# EAGLE design esp (EAGLE 7.5.0)

## Sheet 1 of 2
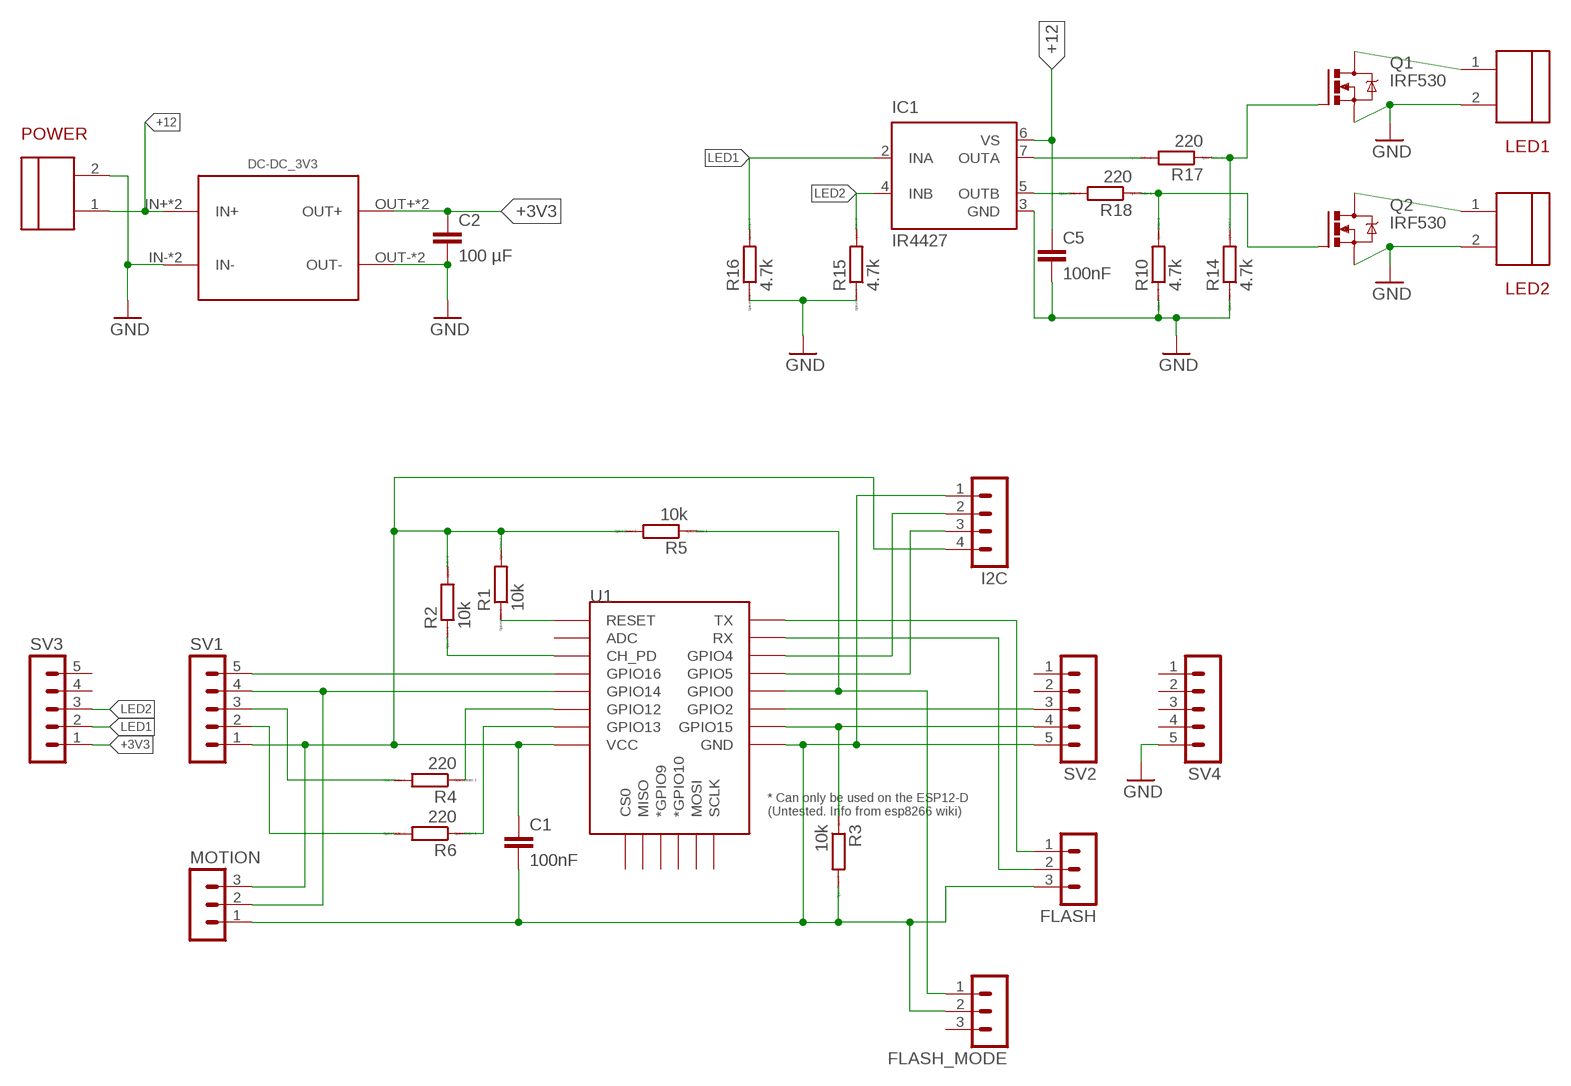
[diagram p0: schematic, sheet 1]

### Parts
C1  100nF  CAPPTH1  [CAP-PTH-5MM]
C2  100 µF  CAPPTH1  [CAP-PTH-5MM]
C5  100nF  CAPPTH1  [CAP-PTH-5MM]
DC-DC_3V3  DC-DC-MP1504EN  [DC-DC-MP1504EN]
FLASH  MA03-1  [MA03-1]
FLASH_MODE  MA03-1  [MA03-1]
I2C  MA04-1  [MA04-1]
IC1  IR4427  [DIL08]
LED1  DG3502P  [DG350]
LED2  DG3502P  [DG350]
MOTION  MA03-1  [MA03-1]
POWER  DG3502P  [DG350]
Q1  IRF530  [TO220BV]
Q2  IRF530  [TO220BV]
R1  10k  RR1206  [R1206]
R2  10k  RR1206  [R1206]
R3  10k  RR1206  [R1206]
R4  220  RR1206  [R1206]
R5  10k  RR1206  [R1206]
R6  220  RR1206  [R1206]
R10  4.7k  RR1206  [R1206]
R14  4.7k  RR1206  [R1206]
R15  4.7k  RR1206  [R1206]
R16  4.7k  RR1206  [R1206]
R17  220  RR1206  [R1206]
R18  220  RR1206  [R1206]
SV1  MA05-1  [MA05-1]
SV2  MA05-1  [MA05-1]
SV3  MA05-1  [MA05-1]
SV4  MA05-1  [MA05-1]
U1  ESP12ESMD  [ESP12E-SMD]

### Nets
+3V3: C2.1 DC-DC_3V3.OUT2+(OUT+) DC-DC_3V3.OUT+ SV3.1
+12: C5.1 DC-DC_3V3.IN2+(IN+) DC-DC_3V3.IN+ IC1.6(VS) POWER.1
GND: C2.2 C5.2 DC-DC_3V3.IN2-(IN-) DC-DC_3V3.IN- DC-DC_3V3.OUT2-(OUT-) DC-DC_3V3.OUT- IC1.3(GND) LED1.2 LED2.2 POWER.2 Q1.S Q2.S R10.1 R14.1 R15.1 R16.1 SV4.5
LED1: IC1.2(INA) R16.2 SV3.2
LED2: IC1.4(INB) R15.2 SV3.3
MOTION_SENSOR: MOTION.2 SV1.4 U1.GPIO14
N$1: R1.1 U1.RESET
N$2: R2.1 U1.CH_PD
N$3: FLASH_MODE.1 R5.1 U1.GPIO0
N$4: R3.1 SV2.4 U1.GPIO15
N$5: LED1.1 Q1.D
N$6: LED2.1 Q2.D
N$9: R6.1 U1.GPIO13
N$10: R4.1 U1.GPIO12
N$11: SV2.3 U1.GPIO2
N$12: C1.1 I2C.4 MOTION.3 R1.2 R2.2 R5.2 SV1.1 U1.VCC
N$13: R6.2 SV1.2
N$14: R4.2 SV1.3
N$16: SV1.5 U1.GPIO16
N$17: FLASH.1 U1.TXD0(TX)
N$18: FLASH.2 U1.RXD0(RX)
N$21: C1.2 FLASH.3 FLASH_MODE.2 I2C.1 MOTION.1 R3.2 SV2.5 U1.GND
N$27: IC1.5(OUTB) R18.2
N$28: Q2.G R10.2 R18.1
N$29: IC1.7(OUTA) R17.2
N$30: Q1.G R14.2 R17.1
SCL: I2C.3 U1.GPIO5
SDA: I2C.2 U1.GPIO4
Unconnected: FLASH_MODE.3 SV2.1 SV2.2 SV3.4 SV3.5 SV4.1 SV4.2 SV4.3 SV4.4 U1.ADC U1.CS0 U1.GPIO9(*GPIO9) U1.GPIO10(*GPIO10) U1.MISO U1.MOSI U1.SCLK

## Sheet 2 of 2
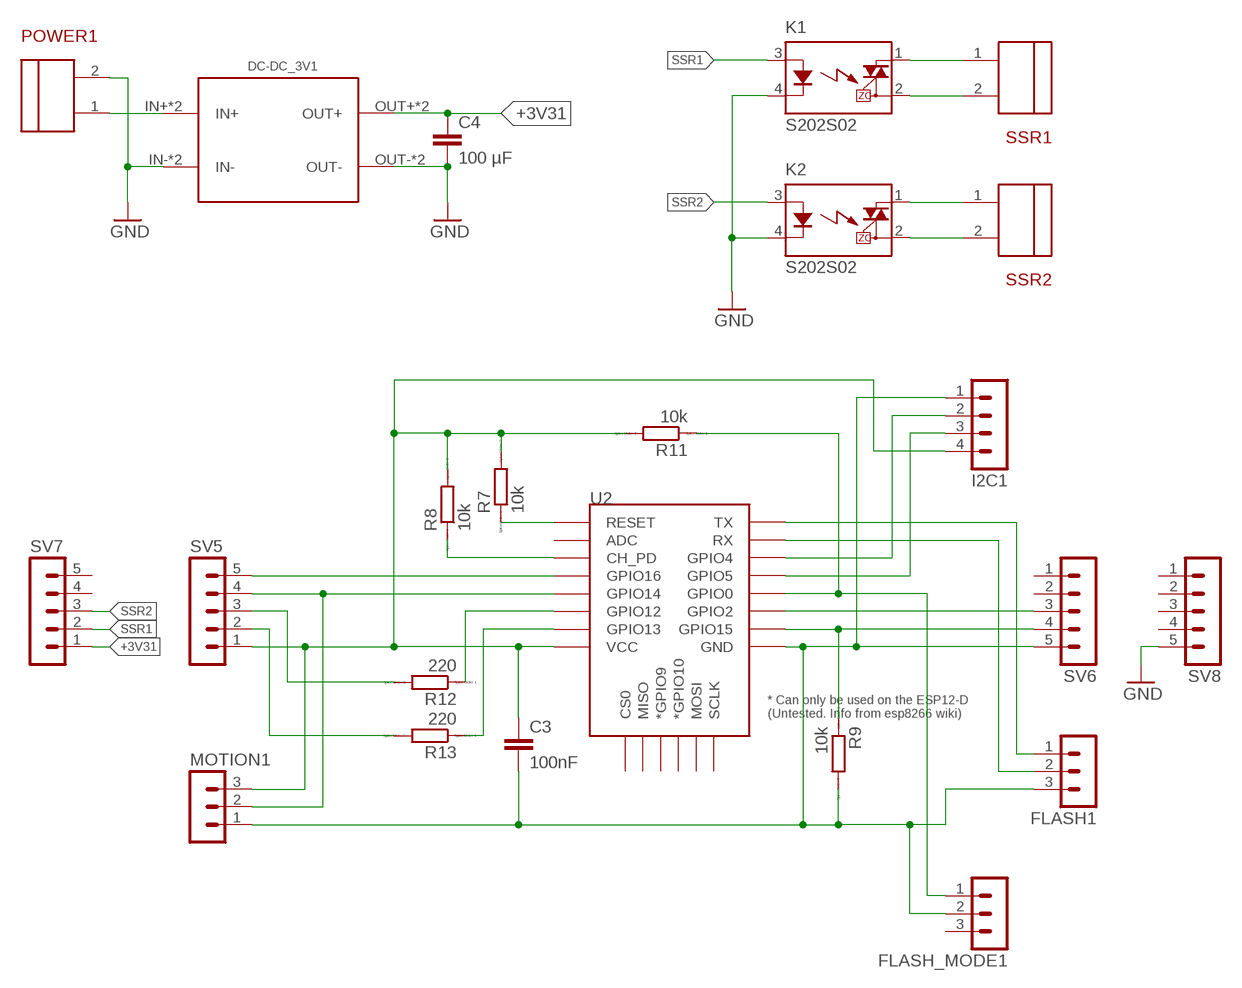
[diagram p1: schematic, sheet 2]

### Parts
C3  100nF  CAPPTH1  [CAP-PTH-5MM]
C4  100 µF  CAPPTH1  [CAP-PTH-5MM]
DC-DC_3V1  DC-DC-MP1504EN  [DC-DC-MP1504EN]
FLASH1  MA03-1  [MA03-1]
FLASH_MODE1  MA03-1  [MA03-1]
I2C1  MA04-1  [MA04-1]
K1  S202S02  [S202S02]
K2  S202S02  [S202S02]
MOTION1  MA03-1  [MA03-1]
POWER1  DG3502P  [DG350]
R7  10k  RR1206  [R1206]
R8  10k  RR1206  [R1206]
R9  10k  RR1206  [R1206]
R11  10k  RR1206  [R1206]
R12  220  RR1206  [R1206]
R13  220  RR1206  [R1206]
SSR1  DG3502P  [DG350]
SSR2  DG3502P  [DG350]
SV5  MA05-1  [MA05-1]
SV6  MA05-1  [MA05-1]
SV7  MA05-1  [MA05-1]
SV8  MA05-1  [MA05-1]
U2  ESP12ESMD  [ESP12E-SMD]

### Nets
+3V31: C4.1 DC-DC_3V1.OUT2+(OUT+) DC-DC_3V1.OUT+ SV7.1
GND1: C4.2 DC-DC_3V1.IN2-(IN-) DC-DC_3V1.IN- DC-DC_3V1.OUT2-(OUT-) DC-DC_3V1.OUT- K1.4(K) K2.4(K) POWER1.2 SV8.5 ; supply symbol labelled GND
MOTION_SENSOR1: MOTION1.2 SV5.4 U2.GPIO14
N$7: R8.1 U2.CH_PD
N$8: FLASH_MODE1.1 R11.1 U2.GPIO0
N$19: R7.1 U2.RESET
N$20: R9.1 SV6.4 U2.GPIO15
N$22: C3.1 I2C1.4 MOTION1.3 R7.2 R8.2 R11.2 SV5.1 U2.VCC
N$23: R13.1 U2.GPIO13
N$24: R12.1 U2.GPIO12
N$25: R13.2 SV5.2
N$26: R12.2 SV5.3
N$31: SV5.5 U2.GPIO16
N$32: FLASH1.1 U2.TXD0(TX)
N$33: FLASH1.2 U2.RXD0(RX)
N$34: C3.2 FLASH1.3 FLASH_MODE1.2 I2C1.1 MOTION1.1 R9.2 SV6.5 U2.GND
N$35: SV6.3 U2.GPIO2
N$36: DC-DC_3V1.IN2+(IN+) DC-DC_3V1.IN+ POWER1.1
N$37: K1.1(DS1) SSR1.1
N$38: K1.2(DS2) SSR1.2
N$39: K2.1(DS1) SSR2.1
N$40: K2.2(DS2) SSR2.2
SCL1: I2C1.3 U2.GPIO5
SDA1: I2C1.2 U2.GPIO4
SSR1: K1.3(A) SV7.2
SSR2: K2.3(A) SV7.3
Unconnected: FLASH_MODE1.3 SV6.1 SV6.2 SV7.4 SV7.5 SV8.1 SV8.2 SV8.3 SV8.4 U2.ADC U2.CS0 U2.GPIO9(*GPIO9) U2.GPIO10(*GPIO10) U2.MISO U2.MOSI U2.SCLK

## Library data of the parts
C1-C5 = Different:CAP: Capacitor Standard 0603 ceramic capacitor, and 0.1" leaded capacitor.
DC-DC_3V1 DC-DC_3V3 = Different:DC-DC-MP1504EN
FLASH FLASH1 FLASH_MODE FLASH_MODE1 MOTION MOTION1 = con-lstb:MA03-1: PIN HEADER; OC_FARNELL: unknown; OC_NEWARK: unknown
I2C I2C1 = con-lstb:MA04-1: PIN HEADER; OC_FARNELL: unknown; OC_NEWARK: unknown
IC1 = ir:IR4427: DUAL LOW SIDE DRIVER Source: ID4426.pdf; MF: INTERNATIONAL RECTIFIER(IR); MPN: IR4427; OC_FARNELL: 1023267; OC_NEWARK: 27C6914
K1 K2 = relay:S*02S02: IT(rms) 8A, Zero Cross type SIP 4pin Triac output SSR Source: http://sharp-world.com/products/device/lineup/data/pdf/datasheet/s102s02_e.pdf; MPN: S202S02F; OC_FARNELL: 1618475; OC_NEWARK: 14N9588
LED1 LED2 POWER POWER1 SSR1 SSR2 = Different:DG350
Q1 Q2 = transistor-power:IRF530: HEXFET Power MOSFET
R1-R18 = eagle-ltspice:R: RESISTOR, European symbol; SPICEMODEL: NONE; SPICEPREFIX: R
SV1-SV8 = con-lstb:MA05-1: PIN HEADER; OC_FARNELL: unknown; OC_NEWARK: unknown
U1 U2 = esp8266modules:ESP12E: ESP12E Module

## Board
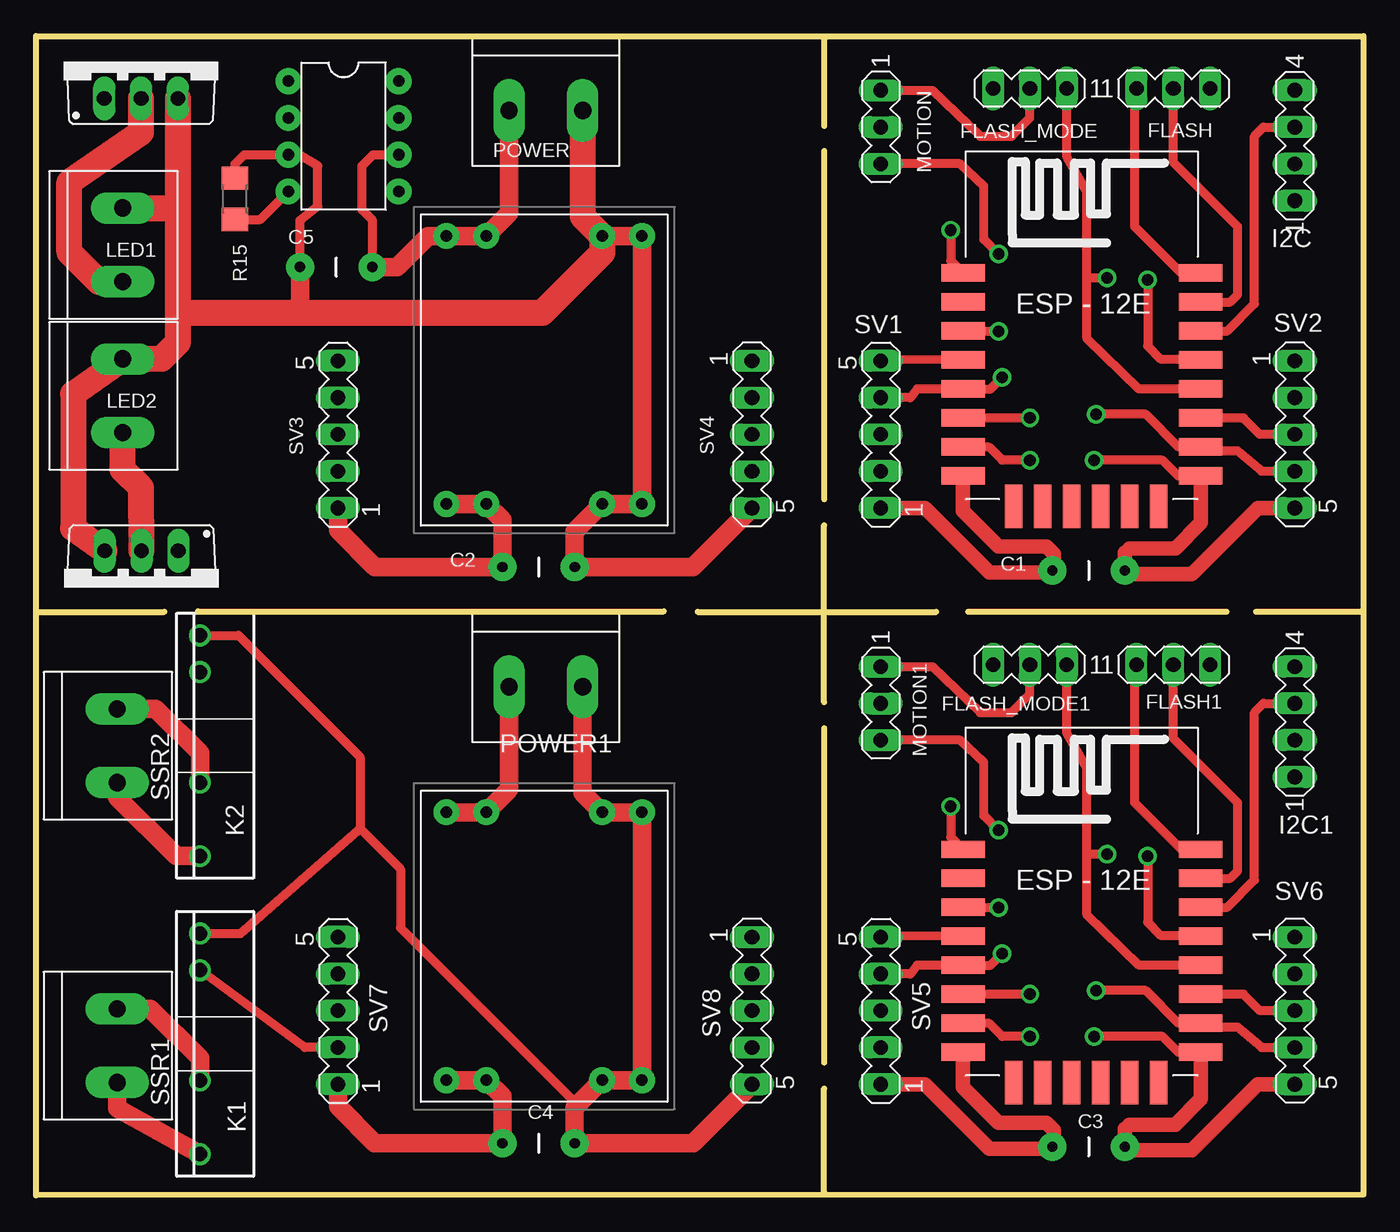
[diagram p2: board, top side]
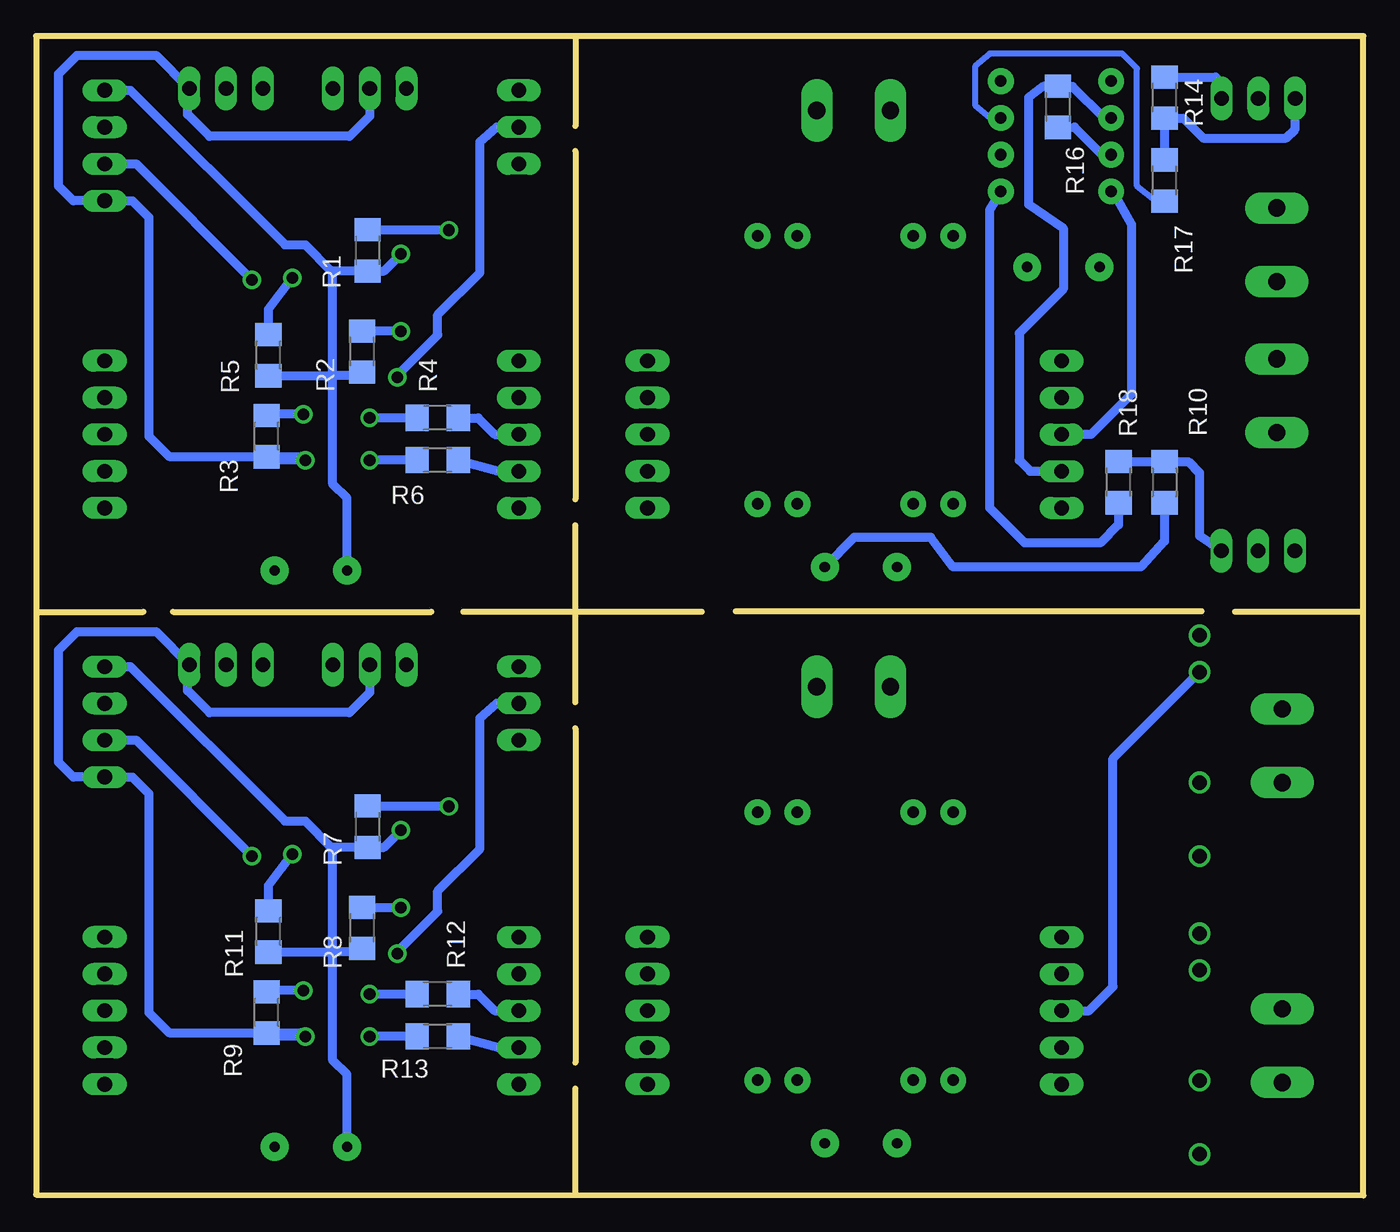
[diagram p3: board, bottom side, seen from below]

Size 91.59 x 80.01 mm. Coordinates in mm from the lower left corner, seen from the top.
Outline: 0.2,0.1 91.59,0.05
Outline: 91.59,0.05 91.59,80.01 0,80.01 0,0 91.59,0.05
Outline: 54.38,79.98 54.38,73.81
Outline: 54.38,34.04 54.38,46.25
Outline: 45.64,40.28 62.13,40.28
Outline: 54.38,72.09 54.38,48.06
Outline: 91.54,40.28 84.2,40.28
Outline: 82.14,40.28 64.31,40.28
Outline: 0.05,40.28 8.84,40.28
Outline: 11.15,40.31 43.31,40.31
Outline: 54.36,0.05 54.38,0.23 54.38,7.39
Outline: 54.38,32.23 54.38,9.17
Copper layers (1*16): Top 0.035mm / dielectric 1.5mm / Bottom 0.035mm
Design rules "dirt_cheap_dirty_boards.v1": minimum track width 5mil, minimum drill 12mil, track to track 5mil, track to pad 5mil, pad to pad 5mil, via to via 5mil, smd to smd 0mil, copper to edge 10mil, drill to drill 10mil, minimum pad ring 10mil, minimum via ring 6mil, stop-mask expansion 2mil, vias tented up to drill 25mil, thermal gap 10mil

### Footprints (pad centres in the part's own frame; a part is rotated, then mirrored left to right if it is on the bottom)
CAP-PTH-5MM = drill 0.7 pad 1.93: 1 -2.5,0; 2 2.5,0
DC-DC-MP1504EN = drill 0.8 pad 1.778: IN2+ -9,-7.246; IN2- -9,3.5; IN+ -9,-4.5; IN- -9,6.246; OUT2+ 9.5,-7.246; OUT2- 9.5,3.5; OUT+ 9.5,-4.5; OUT- 9.5,6.246
MA03-1 = drill 1.016 long: 1 -2.54,0; 2 0,0; 3 2.54,0
MA04-1 = drill 1.016 long: 1 -3.81,0; 2 -1.27,0; 3 1.27,0; 4 3.81,0
DIL08 = drill 0.8 pad 1.778: 1 -3.81,-3.81; 2 -1.27,-3.81; 3 1.27,-3.81; 4 3.81,-3.81; 5 3.81,3.81; 6 1.27,3.81; 7 -1.27,3.81; 8 -3.81,3.81
S202S02 = drill 1: 1 -7.62,0; 2 -2.54,0; 3 5.08,0; 4 7.62,0
DG350 = drill 1.2 pad 2.184 long: 1 -2.54,0; 2 2.54,0
TO220BV = drill 1.016 long: D 0,-2.54; G -2.54,-2.54; S 2.54,-2.54
R1206 = smd 1.6 x 1.803: 1 -1.422,0; 2 1.422,0
MA05-1 = drill 1.016 long: 1 -5.08,0; 2 -2.54,0; 3 0,0; 4 2.54,0; 5 5.08,0
ESP12E-SMD = smd 3 x 1.2: ADC -8.3,3.8; CH_PD -8.3,1.8; GND 8.1,-8.2; GPIO0 8.1,-2.2; GPIO2 8.1,-4.2; GPIO4 8.1,-0.2; GPIO5 8.1,1.8; GPIO12 -8.3,-4.2; GPIO13 -8.3,-6.2; GPIO14 -8.3,-2.2; GPIO15 8.1,-6.2; GPIO16 -8.3,-0.2; RESET -8.3,5.8; RXD0 8.1,3.8; TXD0 8.1,5.8; VCC -8.3,-8.2 | smd 1.2 x 3: CS0 -4.8,-10.3; GPIO9 -0.8,-10.3; GPIO10 1.2,-10.3; MISO -2.8,-10.3; MOSI 3.2,-10.3; SCLK 5.2,-10.3

### Placement (x,y rotation side)
C1  72.64,43.13 0 top
C2  34.67,43.38 0 top
C3  72.64,3.35 0 top
C4  34.67,3.61 0 top
C5  20.7,64.08 180 top
DC-DC_3V1  35.56,17.45 270 top
DC-DC_3V3  35.56,57.23 270 top
FLASH  78.49,76.4 0 top
FLASH1  78.49,36.63 0 top
FLASH_MODE  68.58,76.4 180 top
FLASH_MODE1  68.58,36.63 180 top
I2C  86.87,72.47 90 top
I2C1  86.87,32.69 90 top
IC1  21.21,73.1 270 top
K1  11.3,10.46 90 top
K2  11.3,31.04 90 top
LED1  5.97,65.61 90 top
LED2  5.97,55.19 90 top
MOTION  58.29,73.74 270 top
MOTION1  58.29,33.96 270 top
POWER  35.18,74.88 0 top
POWER1  35.18,35.1 0 top
Q1  7.24,78.26 0 top
Q2  7.26,41.96 180 top
R1  68.71,65.23 270 bottom
R2  69.09,58.24 270 bottom
R3  75.69,52.4 270 bottom
R4  63.88,53.67 0 bottom
R5  75.56,57.99 270 bottom
R6  63.88,50.75 0 bottom
R7  68.71,25.45 270 bottom
R8  69.09,18.47 270 bottom
R9  75.69,12.62 270 bottom
R10  13.72,49.23 90 bottom
R11  75.56,18.21 270 bottom
R12  63.88,13.89 0 bottom
R13  63.88,10.97 0 bottom
R14  13.72,75.77 270 bottom
R15  13.72,68.78 270 top
R16  21.08,75.13 90 bottom
R17  13.72,70.05 270 bottom
R18  16.89,49.23 270 bottom
SSR1  5.59,10.34 90 top
SSR2  5.59,31.04 90 top
SV1  58.29,52.53 90 top
SV2  86.87,52.53 270 top
SV3  20.83,52.53 90 top
SV4  49.4,52.53 270 top
SV5  58.29,12.75 90 top
SV6  86.87,12.75 270 top
SV7  20.83,12.75 90 top
SV8  49.4,12.75 270 top
U1  72.26,57.86 0 top
U2  72.26,18.08 0 top

### Tracks (layer width: path | path; a pad name or v marks a point on that pad's centre or on a via)
+3V3
  Top 1.27: DC-DC_3V3.OUT2+ DC-DC_3V3.OUT+ 32.17,46.62 C2.1 23.37,43.38 20.83,45.92 SV3.1
+3V31
  Top 1.27: DC-DC_3V1.OUT2+ DC-DC_3V1.OUT+ 32.17,6.84 C4.1 23.37,3.61 20.83,6.15 SV7.1
+12
  Top 0.61: C5.1 23.2,67.3 22.48,68.02 22.48,71.07 23.24,71.83 IC1.6
  Top 1.27: POWER.1 32.64,67.81 DC-DC_3V3.IN+ DC-DC_3V3.IN2+ 27.03,66.23 24.89,64.08 C5.1
GND
  Top 0.61: C5.2 18.2,67.3 19.43,68.28 19.43,71.07 18.16,71.83 IC1.3 14.35,71.83 13.72,71.2 R15.1
  Top 1.27: DC-DC_3V3.IN2- DC-DC_3V3.IN- DC-DC_3V3.OUT- DC-DC_3V3.OUT2- 37.17,45.84 C2.2 45.34,43.38 SV4.5 | 9.53,68.15 9.78,67.89 | 10.03,60.91 9.78,61.16 | C5.2 18.2,61.08 18.03,60.91
  Top 1.778: POWER.2 37.72,67.57 DC-DC_3V3.IN2- 39.06,65.04 34.93,60.91 18.03,60.91 10.03,60.91 | Q2.S 2.54,46.05 2.54,55.32 LED2.2 8.64,57.73 9.78,58.88 9.78,61.16 9.78,67.89 Q1.S | LED1.2 9.53,68.15
  Bottom 0.61: R16.1 19.94,73.74 18.03,71.83 IC1.3 | R14.1 10.19,77.19 Q1.S | R10.1 13.72,45.16 15.37,43.38 28.32,43.38 29.85,45.42 35.14,45.42 C2.2
GND1
  Top 0.61: K2.4 13.97,38.66 22.35,30.28 22.35,25.32 | 22.35,25.32 25.15,22.53 25.15,18.47 37.36,6.25 | K1.4 14.1,18.08 22.23,25.2 22.35,25.32
  Top 1.27: SV8.5 45.34,3.61 C4.2 37.17,6.06 37.36,6.25 DC-DC_3V1.OUT2- DC-DC_3V1.OUT- DC-DC_3V1.IN- DC-DC_3V1.IN2- 37.72,27.79 POWER1.2
LED1
  Bottom 0.61: SV3.2 22.99,49.99 23.75,50.75 23.75,59.51 20.7,62.56 20.7,66.75 23.11,68.4 23.11,75.77 22.07,76.56 R16.2 21.06,76.53 20.07,76.53 17.91,74.37 IC1.2
LED2
  Top 0.61: R15.2 15.47,67.36 IC1.4
  Bottom 0.61: IC1.4 17.27,69.29 16,67.01 16,55.32 18.8,52.53 SV3.3
MOTION_SENSOR  (via drill 0.8 pad 1.27)
  Top 0.61: SV1.4 60.33,55.07 60.79,55.66 U1.GPIO14 65.87,55.66 v66.68,56.46
  Bottom 0.61: v66.68,56.46 66.68,56.59 63.88,59.39 63.88,60.78 60.96,63.7 60.96,72.72 59.82,73.74 MOTION.2
MOTION_SENSOR1  (via drill 0.8 pad 1.27)
  Top 0.61: SV5.4 60.33,15.29 60.79,15.88 U2.GPIO14 65.87,15.88 v66.68,16.69
  Bottom 0.61: v66.68,16.69 66.68,16.81 63.88,19.61 63.88,21.01 60.96,23.93 60.96,32.94 59.82,33.96 MOTION1.2
N$1  (via drill 0.8 pad 1.27)
  Top 0.61: v63.12,66.62 63.12,64.51 U1.RESET
  Bottom 0.61: R1.1 63.14,66.65 v63.12,66.62
N$2  (via drill 0.8 pad 1.27)
  Top 0.61: U1.CH_PD 66.4,59.66 v66.42,59.64
  Bottom 0.61: v66.42,59.64 69.06,59.64 R2.1
N$3  (via drill 0.8 pad 1.27)
  Top 0.61: U1.GPIO0 76.11,55.66 72.52,59.13 72.52,63.32 | 72.52,63.32 72.52,69.29 71.12,71.7 FLASH_MODE.1 | v73.91,63.32 72.52,63.32
  Bottom 0.61: R5.1 75.57,61.16 v73.91,63.32
N$4  (via drill 0.8 pad 1.27)
  Top 0.61: v73.15,53.92 76.58,53.92 78.84,51.66 U1.GPIO15 80.64,51.38 82.93,51.38 84.58,49.99 SV2.4
  Bottom 0.61: v73.15,53.92 75.59,53.92 R3.1
N$5
  Top 1.778: LED1.1 4.32,63.07 2.29,65.1 2.29,69.93 7.24,73.36 Q1.D
N$6
  Top 1.778: Q2.D 7.24,48.84 5.97,50.11 LED2.1
N$7  (via drill 0.8 pad 1.27)
  Top 0.61: U2.CH_PD 66.4,19.88 v66.42,19.86
  Bottom 0.61: v66.42,19.86 69.06,19.86 R8.1
N$8  (via drill 0.8 pad 1.27)
  Top 0.61: U2.GPIO0 76.11,15.88 72.52,19.35 72.52,23.55 | 72.52,23.55 72.52,29.51 71.12,31.93 FLASH_MODE1.1 | v73.91,23.55 72.52,23.55
  Bottom 0.61: R11.1 75.57,21.39 v73.91,23.55
N$9  (via drill 0.8 pad 1.27)
  Top 0.61: v68.58,50.75 66.68,50.75 65.79,51.64 63.99,51.64 U1.GPIO13
  Bottom 0.61: R6.1 v68.58,50.75
N$10  (via drill 0.8 pad 1.27)
  Top 0.61: v68.58,53.67 U1.GPIO12
  Bottom 0.61: R4.1 v68.58,53.67
N$11
  Top 0.61: SV2.3 84.46,52.53 83.31,53.67 U1.GPIO2
N$12  (via drill 0.8 pad 1.27)
  Top 0.61: v66.42,64.97 65.41,65.99 65.41,69.67 63.75,71.2 MOTION.3 | 70.02,43 C1.1 70.23,43.22
  Top 1.016: SV1.1 61.34,47.45 65.79,43 70.02,43 | U1.VCC 63.96,47.24 66.42,44.78 69.72,44.78 70.23,44.27 70.23,43.22
  Bottom 0.61: R5.2 75.54,56.59 71.12,56.59 | v66.42,64.97 67.59,63.81 R1.2 71.22,63.81 | C1.1 70.14,48.12 71.12,49.1 71.12,56.59 | I2C.4 85.09,76.28 74.42,65.61 73.03,65.61 71.22,63.81 | 69.72,56.59 69.32,56.59 R2.2 69.11,56.85 69.47,56.85 69.72,56.59 | 71.12,56.59 71.12,63.7 71.22,63.81 | 69.72,56.59 71.12,56.59
N$13
  Bottom 0.61: R6.2 59.69,49.99 SV1.2
N$14
  Bottom 0.61: R4.2 61.09,53.67 59.94,52.53 SV1.3
N$16
  Top 0.61: U1.GPIO16 58.98,57.68 SV1.5
N$17
  Top 0.61: U1.TXD0 79.04,63.66 75.82,66.88 75.82,76.28 FLASH.1
N$18
  Top 0.61: U1.RXD0 82.41,61.66 82.93,62.18 82.93,66.88 78.49,71.32 FLASH.2
N$19  (via drill 0.8 pad 1.27)
  Top 0.61: v63.12,26.85 63.12,24.73 U2.RESET
  Bottom 0.61: R7.1 63.14,26.87 v63.12,26.85
N$20  (via drill 0.8 pad 1.27)
  Top 0.61: v73.15,14.15 76.58,14.15 78.84,11.88 U2.GPIO15 80.64,11.61 82.93,11.61 84.58,10.21 SV6.4
  Bottom 0.61: v73.15,14.15 75.59,14.15 R9.1
N$21  (via drill 0.8 pad 1.27)
  Top 0.61: v73.03,50.75 77.72,50.75 78.81,49.66 U1.GND 80.39,49.63 | 75.4,42.88 C1.2 | MOTION.1 61.85,76.28 65.15,73.1 67.31,73.1 68.58,74.37 FLASH_MODE.2
  Top 1.016: C1.2 75.14,44.36 75.44,44.65 78.61,44.65 80.39,46.43 80.39,49.63 | 75.4,42.88 79.76,42.88 84.33,47.45 SV2.5
  Bottom 0.61: 75.79,50.88 R3.2 75.46,50.75 v73.03,50.75 73.28,51 82.42,51 83.82,52.4 83.82,67.51 84.96,68.66 I2C.1 89.03,68.66 90.04,69.67 90.04,77.42 88.77,78.69 83.31,78.69 FLASH.3 81.15,76.28 81.15,74.63 79.63,73.1 69.98,73.1 68.58,74.5 FLASH_MODE.2
N$22  (via drill 0.8 pad 1.27)
  Top 0.61: v66.42,25.2 65.41,26.21 65.41,29.9 63.75,31.42 MOTION1.3 | 70.02,3.23 C3.1 70.23,3.44
  Top 1.016: SV5.1 61.34,7.67 65.79,3.23 70.02,3.23 | U2.VCC 63.96,7.46 66.42,5 69.72,5 70.23,4.5 70.23,3.44
  Bottom 0.61: R11.2 75.54,16.81 71.12,16.81 | v66.42,25.2 67.59,24.03 R7.2 71.22,24.03 | C3.1 70.14,8.35 71.12,9.32 71.12,16.81 | I2C1.4 85.09,36.5 74.42,25.83 73.03,25.83 71.22,24.03 | 69.72,16.81 69.32,16.81 R8.2 69.11,17.07 69.47,17.07 69.72,16.81 | 71.12,16.81 71.12,23.93 71.22,24.03 | 69.72,16.81 71.12,16.81
N$23  (via drill 0.8 pad 1.27)
  Top 0.61: v68.58,10.97 66.68,10.97 65.79,11.86 63.99,11.86 U2.GPIO13
  Bottom 0.61: R13.1 v68.58,10.97
N$24  (via drill 0.8 pad 1.27)
  Top 0.61: v68.58,13.89 63.96,13.89 U2.GPIO12
  Bottom 0.61: R12.1 v68.58,13.89
N$25
  Bottom 0.61: R13.2 59.69,10.21 SV5.2
N$26
  Bottom 0.61: R12.2 61.09,13.89 59.94,12.75 SV5.3
N$27
  Bottom 0.61: IC1.5 25.78,68.02 25.78,47.45 23.37,45.03 18.16,45.03 16.89,46.3 R18.2
N$28
  Bottom 0.61: R18.1 R10.2 12.09,50.65 11.3,49.86 11.3,45.54 Q2.G
N$29
  Bottom 0.406: R17.2 14.33,68.63 15.62,69.67 15.62,77.8 16.64,78.82 25.78,78.82 26.8,77.93 26.8,75.26 25.78,74.37 IC1.7
N$30
  Bottom 0.61: Q1.G 4.7,73.61 5.33,72.97 11.05,72.97 12.42,74.35 R14.2 R17.1
N$31
  Top 0.61: U2.GPIO16 58.98,17.9 SV5.5
N$32
  Top 0.61: U2.TXD0 79.04,23.88 75.82,27.1 75.82,36.5 FLASH1.1
N$33
  Top 0.61: U2.RXD0 82.41,21.88 82.93,22.4 82.93,27.1 78.49,31.55 FLASH1.2
N$34  (via drill 0.8 pad 1.27)
  Top 0.61: v73.03,10.97 77.72,10.97 78.81,9.88 U2.GND 80.39,9.86 | 75.4,3.1 C3.2 | MOTION1.1 61.85,36.5 65.15,33.32 67.31,33.32 68.58,34.59 FLASH_MODE1.2
  Top 1.016: C3.2 75.14,4.58 75.44,4.88 78.61,4.88 80.39,6.65 80.39,9.86 | 75.4,3.1 79.76,3.1 84.33,7.67 SV6.5
  Bottom 0.61: 75.79,11.1 R9.2 75.46,10.97 v73.03,10.97 73.28,11.23 82.42,11.23 83.82,12.62 83.82,27.74 84.96,28.88 I2C1.1 89.03,28.88 90.04,29.9 90.04,37.64 88.77,38.91 83.31,38.91 FLASH1.3 81.15,36.5 81.15,34.85 79.63,33.32 69.98,33.32 68.58,34.72 FLASH_MODE1.2
N$35
  Top 0.61: SV6.3 84.46,12.75 83.31,13.89 80.37,13.89 U2.GPIO2
N$36
  Top 1.27: DC-DC_3V1.IN2+ DC-DC_3V1.IN+ 32.64,28.03 POWER1.1
N$37
  Top 1.27: SSR1.1 5.59,6.02 K1.1
N$38
  Top 1.27: SSR1.2 7.87,12.88 11.3,9.45 K1.2
N$39
  Top 1.27: SSR2.1 5.59,27.48 9.65,23.42 K2.1
N$40
  Top 1.27: SSR2.2 8.26,33.58 11.3,30.53 K2.2
SCL
  Top 0.61: U1.GPIO5 82.19,59.66 84.07,61.54 84.07,73.1 84.71,73.74 I2C.3
SCL1
  Top 0.61: U2.GPIO5 82.19,19.88 84.07,21.77 84.07,33.32 84.71,33.96 I2C1.3
SDA  (via drill 0.8 pad 1.27)
  Top 0.61: v76.71,63.2 76.71,58.62 77.6,57.73 80.29,57.73 U1.GPIO4
  Bottom 0.61: I2C.2 84.71,71.2 v76.71,63.2
SDA1  (via drill 0.8 pad 1.27)
  Top 0.61: v76.71,23.42 76.71,18.85 77.6,17.96 80.29,17.96 U2.GPIO4
  Bottom 0.61: I2C1.2 84.71,31.42 v76.71,23.42
SSR1
  Top 0.61: SV7.2 18.54,10.21 K1.3
SSR2
  Bottom 0.61: SV7.3 18.92,12.75 17.27,14.4 17.27,30.15 K2.3